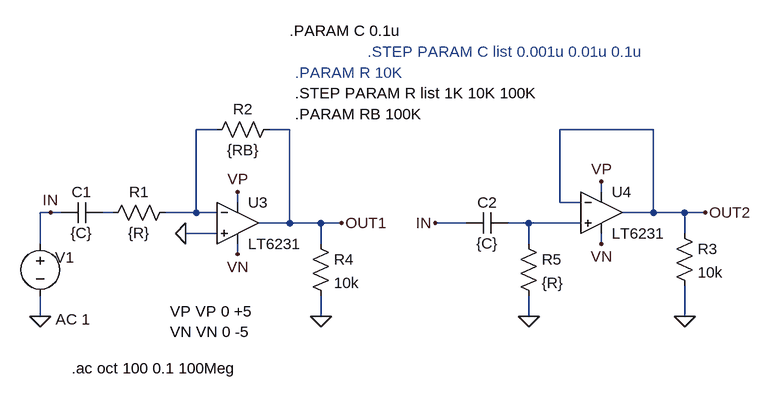
[diagram p0: schematic Fig_8-10_HighPass_Filter_AC.asc]
Fig_8-10_HighPass_Filter_AC.asc, the LTspice schematic file:
Version 4
SHEET 1 1016 680
WIRE 176 0 144 0
WIRE 288 0 256 0
WIRE 848 0 704 0
WIRE 768 96 768 80
WIRE 208 112 208 96
WIRE 704 112 704 0
WIRE 736 112 704 112
WIRE -80 128 -96 128
WIRE -64 128 -80 128
WIRE 16 128 0 128
WIRE 144 128 144 0
WIRE 144 128 96 128
WIRE 176 128 144 128
WIRE 848 128 848 0
WIRE 848 128 800 128
WIRE 896 128 848 128
WIRE 928 128 896 128
WIRE 288 144 288 0
WIRE 288 144 240 144
WIRE 336 144 288 144
WIRE 368 144 336 144
WIRE 560 144 512 144
WIRE 656 144 624 144
WIRE 736 144 656 144
WIRE 176 160 128 160
WIRE 896 160 896 128
WIRE -96 176 -96 128
WIRE 336 176 336 144
WIRE 656 176 656 144
WIRE 768 176 768 160
WIRE 208 192 208 176
WIRE -96 288 -96 256
WIRE 336 288 336 256
WIRE 656 288 656 256
WIRE 896 288 896 240
FLAG 208 96 VP
FLAG 208 192 VN
FLAG 128 160 0
FLAG 368 144 OUT1
FLAG -96 288 0
FLAG -80 128 IN
FLAG 768 80 VP
FLAG 768 176 VN
FLAG 928 128 OUT2
FLAG 512 144 IN
FLAG 656 288 0
FLAG 336 288 0
FLAG 896 288 0
SYMBOL res 0 144 R270
WINDOW 0 32 56 VTop 2
WINDOW 3 0 56 VBottom 2
SYMATTR InstName R1
SYMATTR Value {R}
SYMBOL res 160 16 R270
WINDOW 0 32 56 VTop 2
WINDOW 3 0 56 VBottom 2
SYMATTR InstName R2
SYMATTR Value {RB}
SYMBOL voltage -96 160 R0
WINDOW 123 24 132 Left 2
WINDOW 39 0 0 Left 2
WINDOW 0 23 37 Left 2
SYMATTR Value2 AC 1
SYMATTR InstName V1
SYMATTR Value ""
SYMBOL cap -64 144 R270
WINDOW 0 32 32 VTop 2
WINDOW 3 0 32 VBottom 2
SYMATTR InstName C1
SYMATTR Value {C}
SYMBOL res 640 160 R0
SYMATTR InstName R5
SYMATTR Value {R}
SYMBOL cap 624 128 R90
WINDOW 0 0 32 VBottom 2
WINDOW 3 32 32 VTop 2
SYMATTR InstName C2
SYMATTR Value {C}
SYMBOL Opamps\\LT6231 208 144 R0
SYMATTR InstName U3
SYMBOL Opamps\\LT6231 768 128 R0
SYMATTR InstName U4
SYMBOL res 880 144 R0
SYMATTR InstName R3
SYMATTR Value 10k
SYMBOL res 320 160 R0
SYMATTR InstName R4
SYMATTR Value 10k
TEXT 104 280 Left 2 !VP VP 0 +5\nVN VN 0 -5
TEXT -48 368 Left 2 !.ac oct 100 0.1 100Meg
TEXT 408 -120 Left 2 ;.STEP PARAM C list 0.001u 0.01u 0.1u
TEXT 296 -88 Left 2 ;.PARAM R 10K
TEXT 296 -56 Left 2 !.STEP PARAM R list 1K 10K 100K
TEXT 288 -152 Left 2 !.PARAM C 0.1u
TEXT 296 -24 Left 2 !.PARAM RB 100K

The netlist it stands for:
* Fig_8-10_HighPass_Filter_AC.asc
R1 N002 N001 {R}
R2 N001 OUT1 {RB}
V1 IN 0 AC 1
C1 IN N002 {C}
R5 N003 0 {R}
C2 N003 IN {C}
XU3 0 N001 OUT1 VP VN LT6231  ; pins In+ In- OUT V+ V-
XU4 N003 OUT2 OUT2 VP VN LT6231  ; pins In+ In- OUT V+ V-
R3 OUT2 0 10k
R4 OUT1 0 10k
VP VP 0 +5
VN VN 0 -5
.ac oct 100 0.1 100Meg
* .STEP PARAM C list 0.001u 0.01u 0.1u
* .PARAM R 10K
.STEP PARAM R list 1K 10K 100K
.PARAM C 0.1u
.PARAM RB 100K
.lib LTC2.lib
.backanno
.end